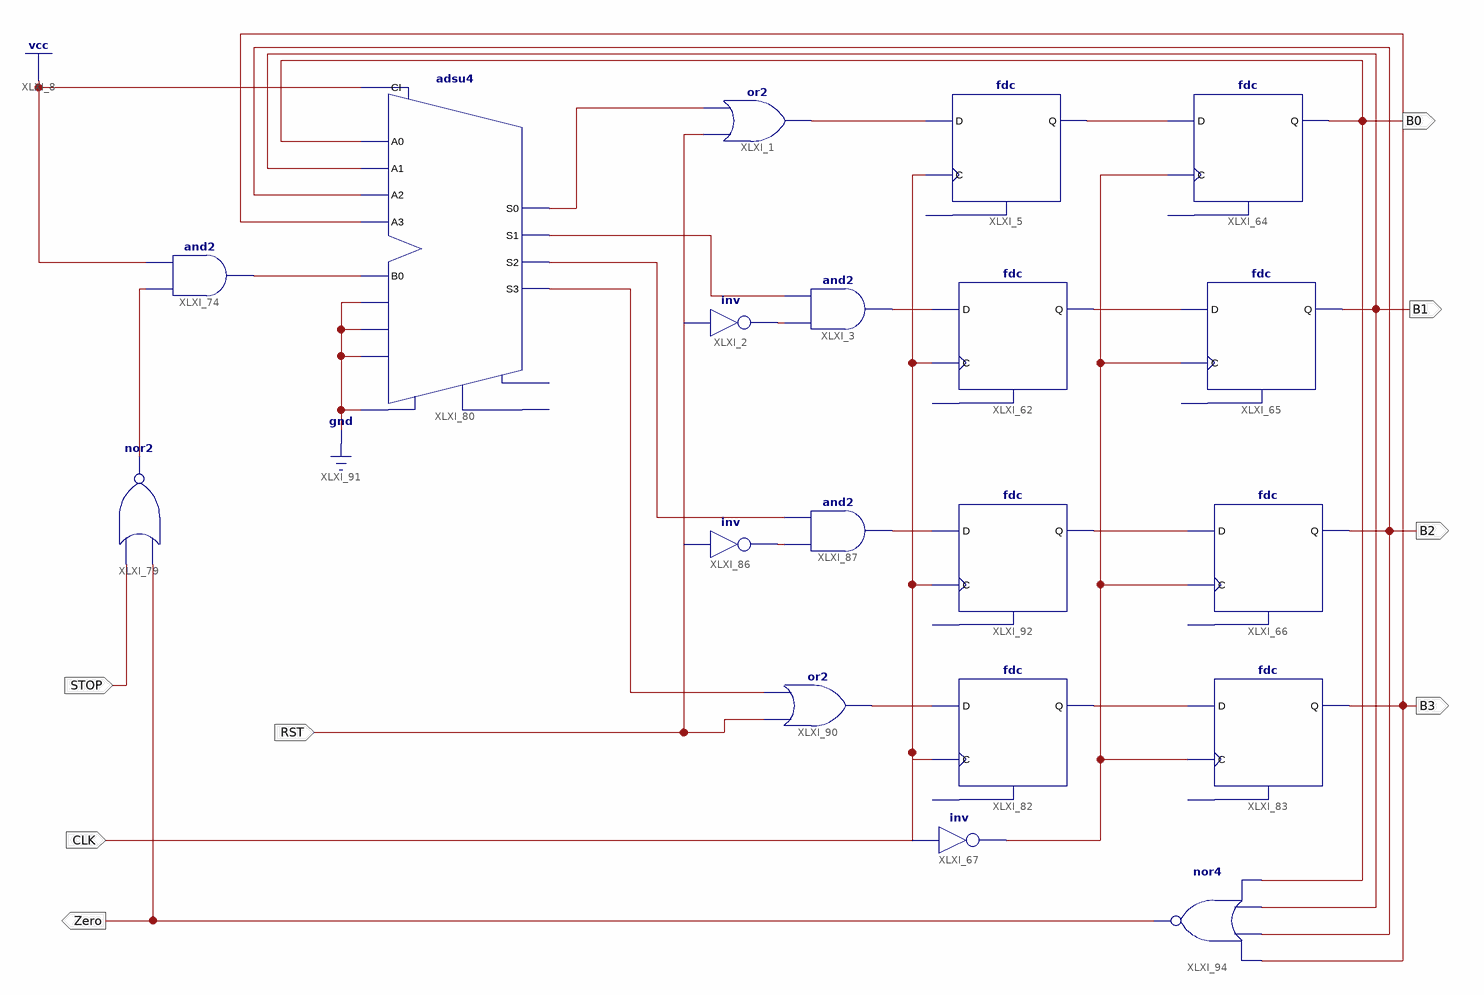
[diagram p0: schematic sheet 1]
// Xilinx ISE schematic Rel_ms.sch (spartan3) as structural Verilog: 19 symbols, 8 ports
module Rel_ms (
  input  RST,
  input  CLK,
  input  STOP,
  output B0,
  output B2,
  output Zero,
  output B1,
  output B3
);

  wire XLXN_2, XLXN_3, XLXN_4, XLXN_5, XLXN_12, XLXN_13, XLXN_94, XLXN_95, XLXN_96, XLXN_99, XLXN_104,
       XLXN_116, XLXN_120, XLXN_128, XLXN_130, XLXN_132, XLXN_133;

  or XLXI_1 (XLXN_2, RST, XLXN_120);
  not XLXI_2 (XLXN_5, RST);
  and XLXI_3 (XLXN_4, XLXN_5, XLXN_12);
  fdc #(.INIT("1")) XLXI_5 (.C(CLK), .D(XLXN_2), .Q(XLXN_94));  // open: CLR
  fdc XLXI_64 (.C(XLXN_99), .D(XLXN_94), .Q(B0));  // open: CLR
  fdc XLXI_65 (.C(XLXN_99), .D(XLXN_96), .Q(B1));  // open: CLR
  fdc XLXI_66 (.C(XLXN_99), .D(XLXN_95), .Q(B2));  // open: CLR
  not XLXI_67 (XLXN_99, CLK);
  and XLXI_74 (XLXN_116, XLXN_104, 1'b1);
  nor XLXI_79 (XLXN_104, Zero, STOP);
  fdc XLXI_62 (.C(CLK), .D(XLXN_4), .Q(XLXN_96));  // open: CLR
  fdc #(.INIT("1")) XLXI_82 (.C(CLK), .D(XLXN_132), .Q(XLXN_128));  // open: CLR
  fdc XLXI_83 (.C(XLXN_99), .D(XLXN_128), .Q(B3));  // open: CLR
  not XLXI_86 (XLXN_130, RST);
  and XLXI_87 (XLXN_3, XLXN_130, XLXN_13);
  or XLXI_90 (XLXN_132, RST, XLXN_133);
  fdc XLXI_92 (.C(CLK), .D(XLXN_3), .Q(XLXN_95));  // open: CLR
  nor XLXI_94 (Zero, B0, B1, B2, B3);
  adsu4 XLXI_80 (
    .A0(B0), .A1(B1), .A2(B2), .A3(B3), .ADD(1'b0), .B0(XLXN_116), .B1(1'b0), .B2(1'b0), .B3(1'b0),
    .CI(1'b1), .S0(XLXN_120), .S1(XLXN_12), .S2(XLXN_13), .S3(XLXN_133));  // open: CO, OFL
endmodule
